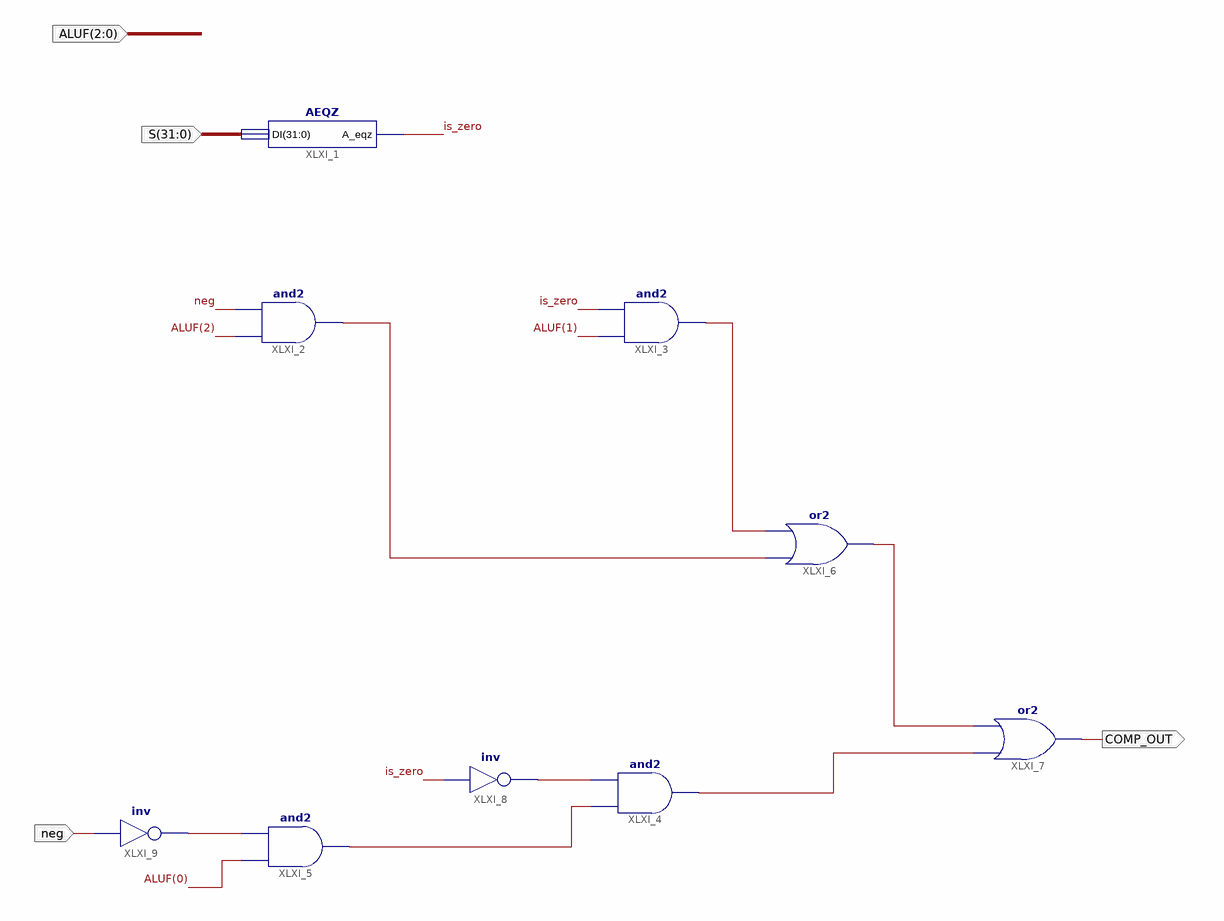
[diagram p0: schematic sheet 1]
// Xilinx ISE schematic DLX_Comparator.sch (spartan6) as structural Verilog: 9 symbols, 4 ports
module DLX_Comparator (
  input  [2:0] ALUF,
  input  [31:0] S,
  input  neg,
  output COMP_OUT
);

  wire is_zero, XLXN_10, XLXN_11, XLXN_12, XLXN_14, XLXN_17, XLXN_18, XLXN_23;

  AEQZ XLXI_1 (.DI(S), .A_eqz(is_zero));
  and XLXI_2 (XLXN_23, ALUF[2], neg);
  and XLXI_3 (XLXN_14, ALUF[1], is_zero);
  and XLXI_4 (XLXN_18, XLXN_11, XLXN_10);
  and XLXI_5 (XLXN_11, ALUF[0], XLXN_12);
  or XLXI_6 (XLXN_17, XLXN_23, XLXN_14);
  or XLXI_7 (COMP_OUT, XLXN_18, XLXN_17);
  not XLXI_8 (XLXN_10, is_zero);
  not XLXI_9 (XLXN_12, neg);
endmodule
